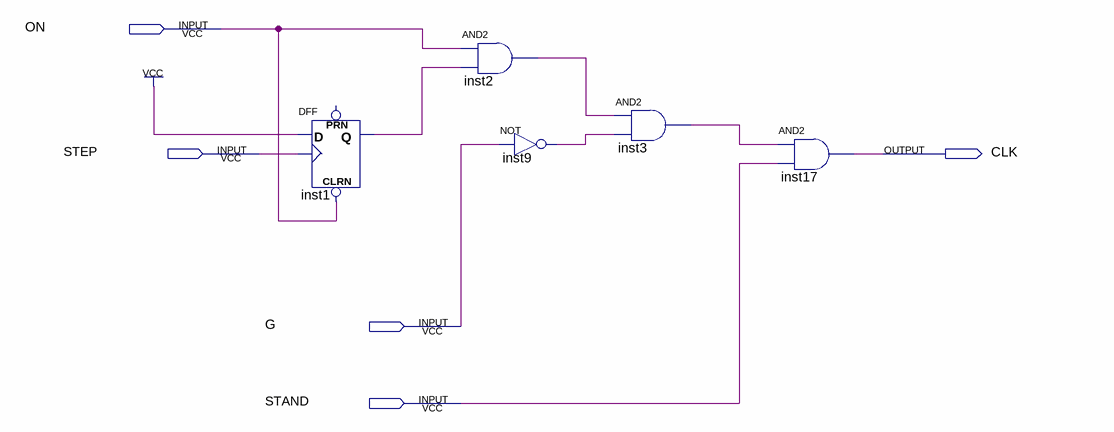
[diagram p0: schematic sheet]
// Quartus schematic START.bdf as structural Verilog: 5 symbols, 5 pins
module START (
  input  ON,
  input  STEP,
  input  G,
  input  STAND,
  output CLK
);

  wire inst1_q, inst2_out, inst3_out, inst9_out;

  DFF inst1 (.CLRN(ON), .CLK(STEP), .D(1'b1), .Q(inst1_q));  // open: PRN
  and inst2 (inst2_out, ON, inst1_q);
  not inst9 (inst9_out, G);
  and inst3 (inst3_out, inst2_out, inst9_out);
  and inst17 (CLK, inst3_out, STAND);
endmodule
